# Altium schematic sheet ADC_Input_Buffering.SchDoc
size A4
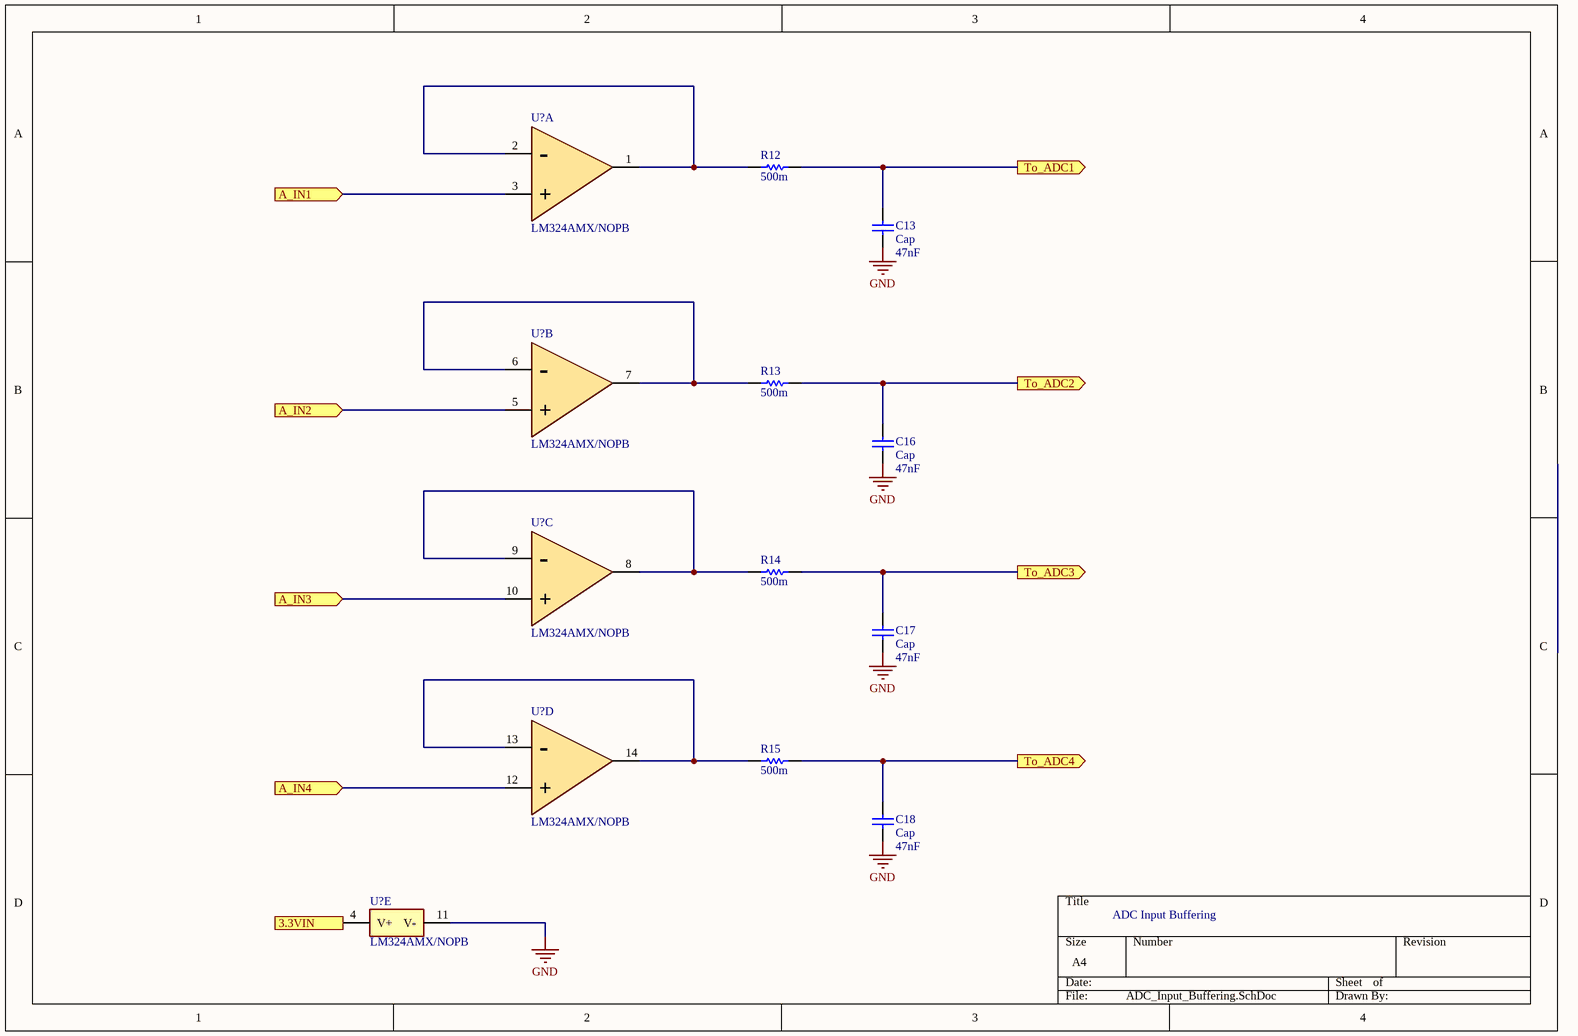
[diagram p0: ADC_Input_Buffering.SchDoc]

## Parts
(Parts that share a designator on the sheet are numbered #1, #2 ... from top to bottom, then left to right.)
C13  Cap  value 47nF  [RAD-0.3]
C16  Cap  value 47nF  [RAD-0.3]
C17  Cap  value 47nF  [RAD-0.3]
C18  Cap  value 47nF  [RAD-0.3]
R12  value 500m  [0603 - Resistor]  (hidden comment: Resistor)
R13  value 500m  [0603 - Resistor]  (hidden comment: Resistor)
R14  value 500m  [0603 - Resistor]  (hidden comment: Resistor)
R15  value 500m  [0603 - Resistor]  (hidden comment: Resistor)
U?#1  LM324AMX/NOPB  [LM324AMX/NOPB]  (part A of 5)
U?#2  LM324AMX/NOPB  [LM324AMX/NOPB]  (part B of 5)
U?#3  LM324AMX/NOPB  [LM324AMX/NOPB]  (part C of 5)
U?#4  LM324AMX/NOPB  [LM324AMX/NOPB]  (part D of 5)
U?#5  LM324AMX/NOPB  [LM324AMX/NOPB]  (part E of 5)

## Ports
3.3VIN (in), A_IN1 (in), A_IN2 (in), A_IN3 (in), A_IN4 (in), To_ADC1 (out), To_ADC2 (out), To_ADC3 (out), To_ADC4 (out)

## Nets
GND: C13.1 C16.1 C17.1 C18.1 U?#5.11(V-)
3.3VIN: U?#5.4(V+) ; port 3.3VIN
A_IN1: U?#1.3(+) ; port A_IN1
A_IN2: U?#2.5(+) ; port A_IN2
A_IN3: U?#3.10(+) ; port A_IN3
A_IN4: U?#4.12(+) ; port A_IN4
To_ADC1: C13.2 R12.2 ; port To_ADC1
To_ADC2: C16.2 R13.2 ; port To_ADC2
To_ADC3: C17.2 R14.2 ; port To_ADC3
To_ADC4: C18.2 R15.2 ; port To_ADC4
NetR12_1: R12.1 U?#1.1 U?#1.2(-)
NetR13_1: R13.1 U?#2.6(-) U?#2.7
NetR14_1: R14.1 U?#3.8 U?#3.9(-)
NetR15_1: R15.1 U?#4.13(-) U?#4.14

## Notes on the sheet
- ADC Input Buffering

## Library data of the parts
C13 C16-C18 = Cap: Capacitor; Published: 8-Jun-2000; LatestRevisionDate: 17-Jul-2002; LatestRevisionNote: Re-released for DXP Platform.; PackageReference: RAD-0.3; Publisher: Altium Limited; PackageDescription: Radial Cap, Thru-Hole; 2 Leads; 0.3 in Pin Spacing
R12-R15 = Resistor: Rating: *; Manufacturer Part Number: *; Manufacturer: *; Supplier Part Number: *; Supplier: *